# Altium schematic sheet buck_converter.SchDoc
size 297 x 209 mm; DrawnBy: Supun; Engineer: Supun; Organization: C3
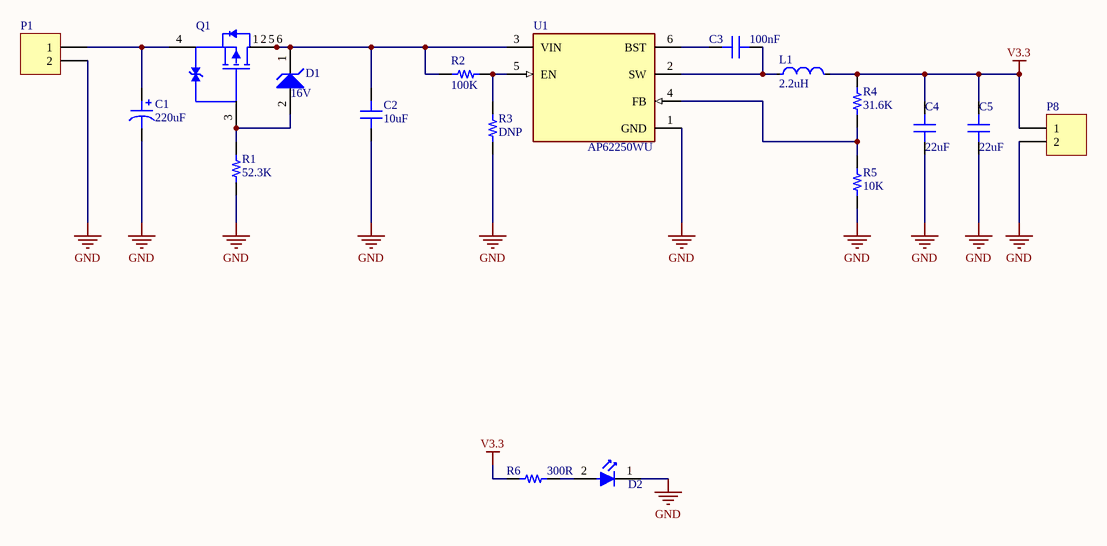
[diagram p0: buck_converter.SchDoc]

## Parts
C1  220uF  [CAP TH ALUM ELEC D10.00mm S5.00mm H12.50mm]
C2  10uF  [CAP 0603_1608]
C3  100nF  [CAP 0603_1608]
C4  22uF  [CAP 0603_1608]
C5  22uF  [CAP 0603_1608]
D1  16V  [Diodes_SOD-123_0]
D2  Red  [Würth_Elektronik_0_MFG]  (value not drawn)
L1  2.2uH  [Vishay_IHLP-2020CZ-FP_1_905x2_79-3D_3_0_MFG]
P1  *  [TEConn_EP2.5_1x2]  (value not drawn)
P8  DNP  [HDR1X2]  (value not drawn)
Q1  P Mosfet  [Diodes_Inc._TSOT26_MFG]  (value not drawn)
R1  52.3K  [RES 0603_1608]
R2  100K  [RES 0603_1608]
R3  DNP  [RES 0603_1608]
R4  31.6K  [RES 0603_1608]
R5  10K  [RES 0603_1608]
R6  300R  [RES 0603_1608]
U1  AP62250WU  [Diodes_Inc._TSOT26_MFG]

## Nets
GND: C1.2 C2.2 C4.2 C5.2 D2.1(C) P1.2 P8.2 R1.2 R3.2 R5.2 U1.1(GND)
V3.3: C4.1 C5.1 L1.2 P8.1 R4.1 R6.1
NetC1_1: C1.1 P1.1 Q1.4(S)
NetC2_1: C2.1 D1.1(K) Q1.1(D) Q1.2(D) Q1.5(D) Q1.6(D) R2.2 U1.3(VIN)
NetC3_1: C3.1 U1.6(BST)
NetC3_2: C3.2 L1.1 U1.2(SW)
NetD1_2: D1.2(A) Q1.3(G) R1.1
NetD2_2: D2.2(A) R6.2
NetR2_1: R2.1 R3.1 U1.5(EN)
NetR4_2: R4.2 R5.1 U1.4(FB)

## Notes on the sheet
- Title
- Size:
- Date:
- A4
- Number:
- Time:
- Revision:
- Sheet
- of
- File:

## Library data of the parts
C1 = Polarised Capacitor: SMT Polarised Capacitor; MF: KEMET; MP: ESK227M035AH1AA; Value: 220uF; Link: https://www.mouser.com/ProductDetail/KEMET/ESH227M050AH1AA?qs=w9hhVRgtvfmnb2YOvt619g%3D%3D
C2 = Capacitor: SMT Capacitor; MF: Murata; MP: GRM188R61C106MAALD; Value: 10uF; Link: https://www.mouser.com/ProductDetail/Murata-Electronics/GRM188R61C106MAALD?qs=hNud%2FORuBR3LEOKZ4RJp9w%3D%3D
C3 = Capacitor: SMT Capacitor; MF: TDK; MP: CGA3E2X7R1E104K080AA; Value: 100nF; Link: https://www.mouser.com/ProductDetail/TDK/CGA3E2X7R1E104K080AA?qs=NRhsANhppD%2Fm7%2FOmmsm0vg%3D%3D
C4 C5 = Capacitor: SMT Capacitor; MF: Murata; MP: GRM188R61A226ME15D; Value: 22uF; Link: https://www.mouser.com/ProductDetail/Murata-Electronics/GRM188R61A226ME15D?qs=eeBpzGFlv%252B8DV%2FrilzyhAw%3D%3D
D1 = Zener Diode: Zener Voltage Regulator; Manufacturer: On Semiconductor; Packing: Tape and Reel; P Max (W): 0.5; VZ Typ (V): 4.7; MF: Onsemi; MP: MMSZ5246BT1G; ComponentLink1Description: Manufacturer URL; ComponentLink2Description: Datasheet; DatasheetVersion: Rev. 12; ComponentLink3URL: http://www.onsemi.com/pub_link/Collateral/425-04.PDF; ComponentLink3Description: Package Specification; ComponentLink1URL: http://www.onsemi.com/; ComponentLink2URL: http://www.onsemi.com/pub_link/Collateral/MMSZ5221BT1-D.PDF; PackageVersion: Rev. G, 10/2009; PackageReference: SOD-123-2-425-04; PackageDescription: 2-Pin SOD, Body 1.6 x 2.69 mm; Mounting Technology: Surface Mount; RoHS: Pb-Free; Value: 16V; Link: https://www.mouser.com/ProductDetail/onsemi/MMSZ5246BT1G?qs=P4IOph%252Bbot93aqBP107C%2FQ%3D%3D
D2 = LED SMD: Led Diffused SMD; MF: LiteOn; MP: LTST-C190KRKT; Value: Red; Link: https://www.mouser.com/ProductDetail/Lite-On/LTST-C190KRKT?qs=kAD5fFa1n5VY3YYNWPC1Fg%3D%3D
L1 = Inductor_sm: Fixed Inductors 2.2uH 20% High Temp AEC-Q200; MF: Vishay; MP: IHLP2020CZER2R2M11; Value: 2.2uH; Link: https://www.mouser.com/ProductDetail/Vishay-Dale/IHLP2020CZER2R2M11?qs=6luCnr706CzLTrsnHEyf2A%3D%3D
P1 = Header 2H: Header, 2-Pin, Right Angle; MF: TE Connectivity; MP: 1744426-2; LatestRevisionDate: 17-Jul-2002; LatestRevisionNote: Re-released for DXP Platform.; Publisher: Altium Limited; Value: *; Link: https://www.mouser.com/ProductDetail/TE-Connectivity-AMP/1744426-2?qs=IGPQaF7TU6sqa55bZxfMjA%3D%3D
P8 = Header 2: Header, 2-Pin; LatestRevisionDate: 17-Jul-2002; LatestRevisionNote: Re-released for DXP Platform.; Publisher: Altium Limited; Value: DNP; Link: https://
Q1 = Mosfet-P-6_ESD: P-Channel Enhancement Mode MOS Transistor, 3-Pin SOT23; MF: Vishay; MP: SI3421DV-T1-GE3; Value: P Mosfet; Link: https://www.mouser.com/ProductDetail/Vishay-Semiconductors/SI3421DV-T1-GE3?qs=dpt6vIvaxwjvmZPXyyVpRg%3D%3D
R1 = Resistor: SMT Resistor; MF: YAGEO; MP: AC0603FR-0752K3L; Value: 52.3K; Link: https://www.mouser.com/ProductDetail/YAGEO/AC0603FR-0752K3L?qs=ygRr%2Ftkhtes52vQmIU4puQ%3D%3D
R2 R3 = Resistor: SMT Resistor; MF: YAGEO; MP: AC0603FR-07100KL; Link: https://www.mouser.com/ProductDetail/YAGEO/AC0603FR-07100KL?qs=UoPT7wUmgYKBKZ83mTH%252BSA%3D%3D
  R2: Value: 100K
  R3: Value: DNP
R4 = Resistor: SMT Resistor; MF: YAGEO; MP: AC0603FR-0731K6L; Value: 31.6K; Link: https://www.mouser.com/ProductDetail/YAGEO/AC0603FR-0731K6L?qs=sGAEpiMZZMvdGkrng054t7zOzNqIRvGcLu2vFpoTK4k%3D
R5 = Resistor: SMT Resistor; MF: YAGEO; MP: AC0603FR-0710KL; Value: 10K; Link: https://www.mouser.com/ProductDetail/YAGEO/AC0603FR-0710KL?qs=UoPT7wUmgYKz3zh0UDMA4Q%3D%3D
R6 = Resistor: SMT Resistor; MF: YAGEO; MP: AC0603FR-07300RL; Value: 300R; Link: https://www.mouser.com/ProductDetail/YAGEO/AC0603FR-07300RL?qs=yhV1fb9g%2FKYRCKndxB9juA%3D%3D
U1 = AP62250WU: Switching Voltage Regulators DCDC Conv HV Buck TSOT26; MF: Diodes Incorporated; MP: AP62250WU-7; Link: https://www.mouser.com/ProductDetail/Diodes-Incorporated/AP62250WU-7?qs=7MVldsJ5Uax1PUc8sdeimQ%3D%3D